# Altium schematic sheet Power.SchDoc
size 127 x 88 mm
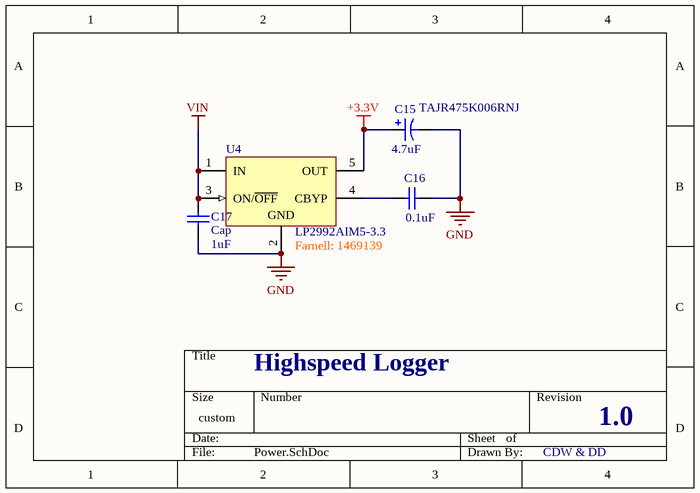
[diagram p0: Power.SchDoc]

## Parts
C15  TAJR475K006RNJ  value 4.7uF  [0805]
C16  value 0.1uF  [V0402]  (hidden comment: Cap)
C17  Cap  value 1uF  [V0402]
U4  LP2992AIM5-3.3  Farnell: 1469139  [MF05A_N]

## Nets
+3.3V: C15.1 U4.5(OUT)
GND: C15.2 C16.2 C17.1 U4.2(GND)
VIN: C17.2 U4.1(IN) U4.3(ON/~{OFF})
NetC16_1: C16.1 U4.4(CBYP)

## Notes on the sheet
- Highspeed Logger
- 1.0
- CDW & DD

## Library data of the parts
C15 = Cap Pol3: Polarized Capacitor (Surface Mount); Published: 8-Jun-2000; LatestRevisionDate: 29-May-2009; LatestRevisionNote: IPC-7351 Footprint Added.; PackageReference: C0805; Publisher: Altium Limited; PackageDescription: Chip Capacitor
C16 C17 = Cap: Capacitor; Published: 8-Jun-2000; LatestRevisionDate: 17-Jul-2002; LatestRevisionNote: Re-released for DXP Platform.; PackageReference: RAD-0.3; Publisher: Altium Limited; PackageDescription: Radial Cap, Thru-Hole; 2 Leads; 0.3 in Pin Spacing
U4 = LP2992AIM5-3.3: Micropower 250 mA Low-Noise Ultra Low-Dropout Regulator, 5-pin SOT-23; Manufacturer: National Semiconductor; PackageTopMarking: LFEA*XTT; PowerWise: N; CompType: LDO IC; Published: 4-Dec-2008; DatasheetVersion: May-2005; PackageVersion: revD, Aug-2008; PackageReference: MF05A; Publisher: Altium Limited; PackageDescription: Molded SOT-23, .115 x .063 x .040 in Body, 5 Lead, .0375 in Pitch; PartNumber: LP2992AIM5-3.3; RoHS: N; PinCount: 5; ComponentLink1Description: LP2992 Datasheet; ComponentLink1URL: http://www.national.com/ds/LP/LP2992.pdf; ComponentLink2Description: LP2992 Web Page; ComponentLink2URL: http://www.national.com/pf/LP/LP2992.html; ComponentLink3Description: MF05A Package Page; ComponentLink3URL: http://www.national.com/packaging/folders/mf05a.html